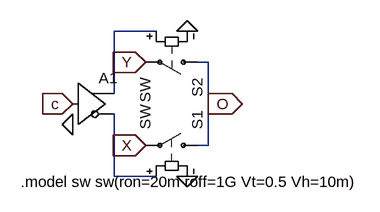
[diagram p0: schematic amux-2to1.asc]
amux-2to1.asc, the LTspice schematic file:
Version 4
SHEET 1 880 680
WIRE 64 -160 0 -160
WIRE 144 -112 128 -112
WIRE 0 -64 0 -160
WIRE 144 -48 144 -112
WIRE 144 16 144 -48
WIRE 144 16 128 16
WIRE 0 64 0 -32
WIRE 64 64 0 64
FLAG 112 64 0
FLAG -64 -48 c
IOPIN -64 -48 In
FLAG 112 -160 0
FLAG 48 16 X
IOPIN 48 16 In
FLAG 48 -112 Y
IOPIN 48 -112 In
FLAG 144 -48 O
IOPIN 144 -48 Out
FLAG -64 -16 0
SYMBOL sw 144 16 M270
SYMATTR InstName S1
SYMBOL sw 144 -112 R90
SYMATTR InstName S2
SYMBOL Digital\\buf -64 -112 R0
SYMATTR InstName A1
TEXT -144 72 Left 0 !.model sw sw(ron=20m roff=1G Vt=0.5 Vh=10m)

The netlist it stands for:
* amux-2to1.asc
S1 O X N002 0 SW
S2 O Y N001 0 SW
A1 c 0 0 0 0 N002 N001 0 BUF
.model sw sw(ron=20m roff=1G Vt=0.5 Vh=10m)
.backanno
.end